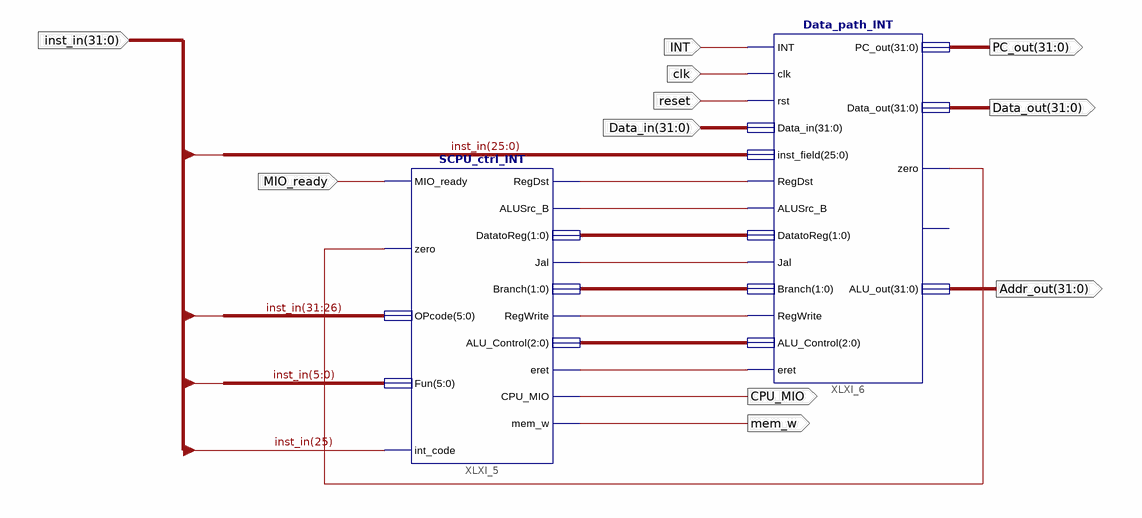
[diagram p0: schematic sheet 1]
// Xilinx ISE schematic SCPU_INT.sch (kintex7) as structural Verilog: 2 symbols, 11 ports
module SCPU_INT (
  input  MIO_ready,
  input  INT,
  input  clk,
  input  reset,
  input  [31:0] inst_in,
  input  [31:0] Data_in,
  output CPU_MIO,
  output mem_w,
  output [31:0] Addr_out,
  output [31:0] Data_out,
  output [31:0] PC_out
);

  wire XLXN_61, XLXN_62, XLXN_64, XLXN_66, XLXN_68, XLXN_72;
  wire [1:0] XLXN_63, XLXN_65;
  wire [2:0] XLXN_67;

  SCPU_ctrl_INT XLXI_5 (
    .MIO_ready(MIO_ready), .zero(XLXN_72), .OPcode(inst_in[31:26]), .Fun(inst_in[5:0]), .RegDst(XLXN_61),
    .ALUSrc_B(XLXN_62), .Jal(XLXN_64), .RegWrite(XLXN_66), .mem_w(mem_w), .CPU_MIO(CPU_MIO), .eret(XLXN_68),
    .DatatoReg(XLXN_63), .Branch(XLXN_65), .ALU_Control(XLXN_67), .int_code(inst_in[25]));
  Data_path_INT XLXI_6 (
    .Data_in(Data_in), .eret(XLXN_68), .PC_out(PC_out), .Data_out(Data_out), .zero(XLXN_72),
    .ALU_out(Addr_out), .INT(INT), .ALU_Control(XLXN_67), .RegWrite(XLXN_66), .Branch(XLXN_65),
    .Jal(XLXN_64), .DatatoReg(XLXN_63), .ALUSrc_B(XLXN_62), .RegDst(XLXN_61), .inst_field(inst_in[25:0]),
    .rst(reset), .clk(clk));  // open: overflow
endmodule
